# EAGLE design base-6u-generic-m16-v2 (EAGLE 5.06)
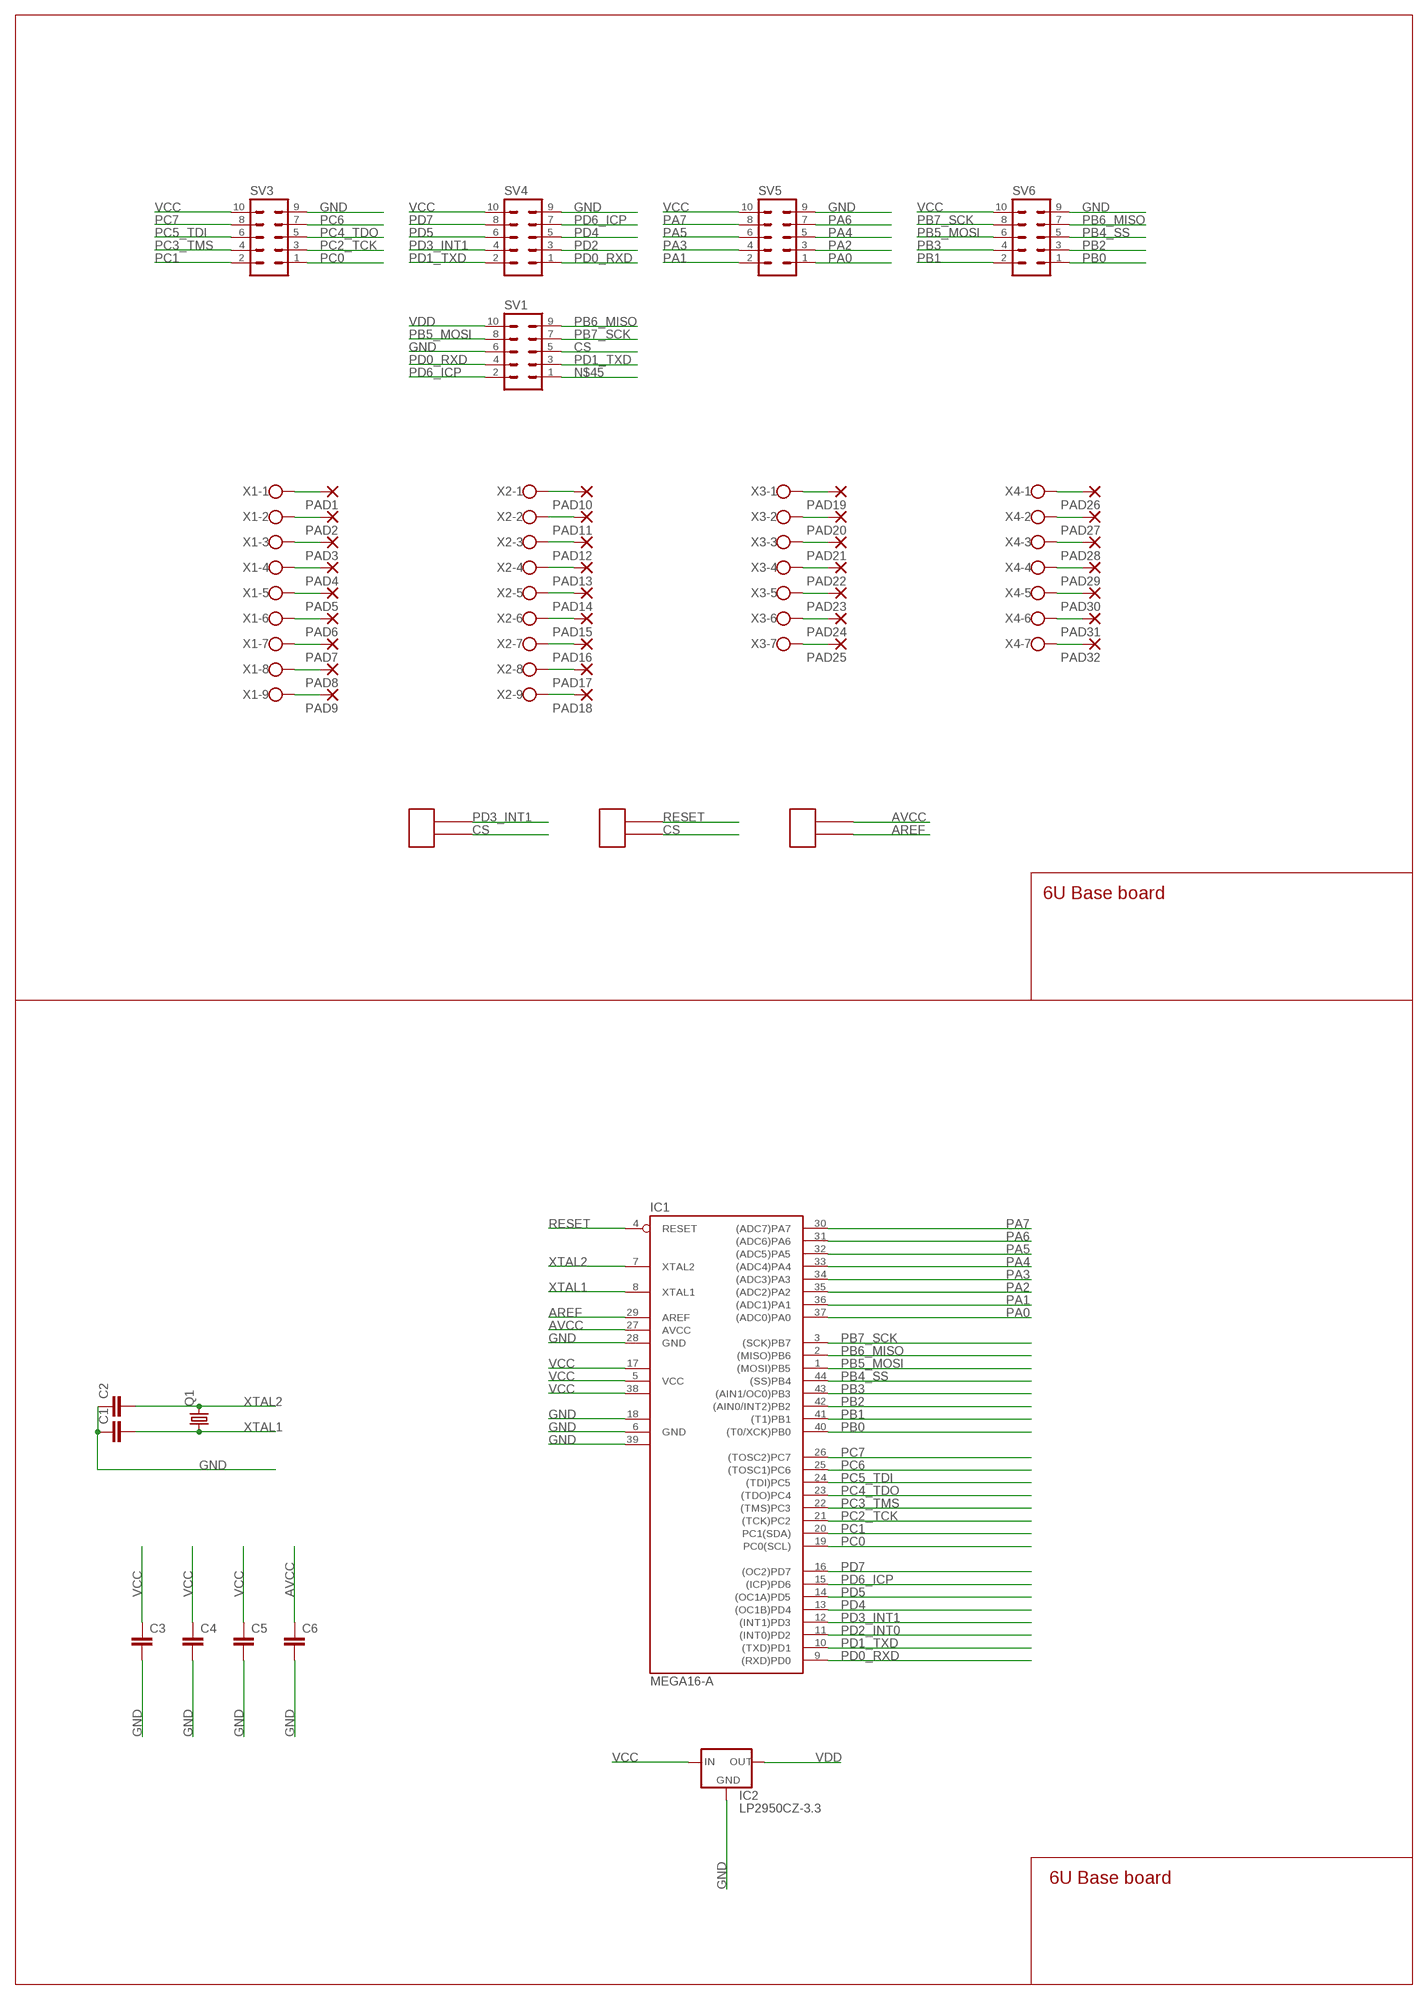
[diagram p0: schematic, sheet 1]

## Parts
C1  C-EUC0805  [C0805]
C2  C-EUC0805  [C0805]
C3  C-EUC0603  [C0603]
C4  C-EUC0603  [C0603]
C5  C-EUC0603  [C0603]
C6  C-EUC0603  [C0603]
IC1  MEGA16-A  [TQFP44]
IC2  LP2950CZ-3.3  [TO92]
PAD1  2,54/0,8  [2,54/0,8]
PAD2  2,54/0,8  [2,54/0,8]
PAD3  2,54/0,8  [2,54/0,8]
PAD4  2,54/0,8  [2,54/0,8]
PAD5  2,54/0,8  [2,54/0,8]
PAD6  2,54/0,8  [2,54/0,8]
PAD7  2,54/0,8  [2,54/0,8]
PAD8  2,54/0,8  [2,54/0,8]
PAD9  2,54/0,8  [2,54/0,8]
PAD10  2,54/0,8  [2,54/0,8]
PAD11  2,54/0,8  [2,54/0,8]
PAD12  2,54/0,8  [2,54/0,8]
PAD13  2,54/0,8  [2,54/0,8]
PAD14  2,54/0,8  [2,54/0,8]
PAD15  2,54/0,8  [2,54/0,8]
PAD16  2,54/0,8  [2,54/0,8]
PAD17  2,54/0,8  [2,54/0,8]
PAD18  2,54/0,8  [2,54/0,8]
PAD19  2,54/0,8  [2,54/0,8]
PAD20  2,54/0,8  [2,54/0,8]
PAD21  2,54/0,8  [2,54/0,8]
PAD22  2,54/0,8  [2,54/0,8]
PAD23  2,54/0,8  [2,54/0,8]
PAD24  2,54/0,8  [2,54/0,8]
PAD25  2,54/0,8  [2,54/0,8]
PAD26  2,54/0,8  [2,54/0,8]
PAD27  2,54/0,8  [2,54/0,8]
PAD28  2,54/0,8  [2,54/0,8]
PAD29  2,54/0,8  [2,54/0,8]
PAD30  2,54/0,8  [2,54/0,8]
PAD31  2,54/0,8  [2,54/0,8]
PAD32  2,54/0,8  [2,54/0,8]
Q1  CRYSTALHC49S  [HC49/S]
SV1  MA05-2  [MA05-2]
SV3  MA05-2  [MA05-2]
SV4  MA05-2  [MA05-2]
SV5  MA05-2  [MA05-2]
SV6  MA05-2  [MA05-2]
U$1  MA02-1  [MA02-1]
U$2  MA02-1  [MA02-1]
U$3  MA02-1  [MA02-1]
X1  W237-09P  [W237-9P]
X2  W237-09P  [W237-9P]
X3  W237-07P  [W237-7P]
X4  W237-07P  [W237-7P]

## Nets
AREF: IC1.29(AREF) U$3.P1
AVCC: C6.1 IC1.27(AVCC) U$3.P2
CS: SV1.5 U$1.P1 U$2.P1
GND: C1.1 C2.1 C3.2 C4.2 C5.2 C6.2 IC1.6(GND) IC1.18(GND1) IC1.28(GND) IC1.39(GND2) IC2.2(GND) SV1.6 SV3.9 SV4.9 SV5.9 SV6.9
N$1: PAD1.1(P) X1.1
N$2: PAD2.1(P) X1.2
N$3: PAD3.1(P) X1.3
N$5: PAD4.1(P) X1.4
N$6: PAD5.1(P) X1.5
N$7: PAD6.1(P) X1.6
N$8: PAD7.1(P) X1.7
N$9: PAD8.1(P) X1.8
N$11: PAD9.1(P) X1.9
N$12: PAD10.1(P) X2.1
N$13: PAD11.1(P) X2.2
N$14: PAD12.1(P) X2.3
N$15: PAD13.1(P) X2.4
N$16: PAD14.1(P) X2.5
N$17: PAD15.1(P) X2.6
N$18: PAD16.1(P) X2.7
N$19: PAD17.1(P) X2.8
N$20: PAD18.1(P) X2.9
N$21: PAD19.1(P) X3.1
N$22: PAD20.1(P) X3.2
N$23: PAD21.1(P) X3.3
N$24: PAD22.1(P) X3.4
N$25: PAD23.1(P) X3.5
N$26: PAD24.1(P) X3.6
N$27: PAD25.1(P) X3.7
N$28: PAD26.1(P) X4.1
N$29: PAD27.1(P) X4.2
N$30: PAD28.1(P) X4.3
N$31: PAD29.1(P) X4.4
N$32: PAD30.1(P) X4.5
N$33: PAD31.1(P) X4.6
N$34: PAD32.1(P) X4.7
N$45: SV1.1
PA0: IC1.37((ADC0)PA0) SV5.1
PA1: IC1.36((ADC1)PA1) SV5.2
PA2: IC1.35((ADC2)PA2) SV5.3
PA3: IC1.34((ADC3)PA3) SV5.4
PA4: IC1.33((ADC4)PA4) SV5.5
PA5: IC1.32((ADC5)PA5) SV5.6
PA6: IC1.31((ADC6)PA6) SV5.7
PA7: IC1.30((ADC7)PA7) SV5.8
PB0: IC1.40((T0/XCK)PB0) SV6.1
PB1: IC1.41((T1)PB1) SV6.2
PB2: IC1.42((AIN0/INT2)PB2) SV6.3
PB3: IC1.43((AIN1/OC0)PB3) SV6.4
PB4_SS: IC1.44((SS)PB4) SV6.5
PB5_MOSI: IC1.1((MOSI)PB5) SV1.8 SV6.6
PB6_MISO: IC1.2((MISO)PB6) SV1.9 SV6.7
PB7_SCK: IC1.3((SCK)PB7) SV1.7 SV6.8
PC0: IC1.19(PC0(SCL)) SV3.1
PC1: IC1.20(PC1(SDA)) SV3.2
PC2_TCK: IC1.21((TCK)PC2) SV3.3
PC3_TMS: IC1.22((TMS)PC3) SV3.4
PC4_TDO: IC1.23((TDO)PC4) SV3.5
PC5_TDI: IC1.24((TDI)PC5) SV3.6
PC6: IC1.25((TOSC1)PC6) SV3.7
PC7: IC1.26((TOSC2)PC7) SV3.8
PD0_RXD: IC1.9((RXD)PD0) SV1.4 SV4.1
PD1_TXD: IC1.10((TXD)PD1) SV1.3 SV4.2
PD2: SV4.3
PD2_INT0: IC1.11((INT0)PD2)
PD3_INT1: IC1.12((INT1)PD3) SV4.4 U$1.P2
PD4: IC1.13((OC1B)PD4) SV4.5
PD5: IC1.14((OC1A)PD5) SV4.6
PD6_ICP: IC1.15((ICP)PD6) SV1.2 SV4.7
PD7: IC1.16((OC2)PD7) SV4.8
RESET: IC1.4(RESET) U$2.P2
VCC: C3.1 C4.1 C5.1 IC1.5(VCC) IC1.17(VCC1) IC1.38(VCC2) IC2.3(IN) SV3.10 SV4.10 SV5.10 SV6.10
VDD: IC2.1(OUT) SV1.10
XTAL1: C1.2 IC1.8(XTAL1) Q1.1
XTAL2: C2.2 IC1.7(XTAL2) Q1.2

## Notes on the sheet
- 6U Base board
- 6U Base board

## Library data of the parts
C1-C6 = rcl:C-EU: CAPACITOR, European symbol
IC1 = atmel:MEGA16: MICROCONTROLLER 16 Kbytes FLASH 1 kbytes SRAM 512 bytes EEPROM USART 8-channel 10 bit ADC Source: avr.lbr
IC2 = v-reg:LP2950?*: Source: http://cache.national.com/ds/LP/LP2950.pdf
PAD1-PAD32 = wirepad:2,54/0,8: THROUGH-HOLE PAD
Q1 = crystal:CRYSTAL: CRYSTAL
SV1 SV3-SV6 = con-lstb:MA05-2: PIN HEADER
U$1-U$3 = my-con:MA02-1
X1 X2 = con-wago-508:W237-09P: WAGO SREW CLAMP
X3 X4 = con-wago-508:W237-07P: WAGO SREW CLAMP

## Board
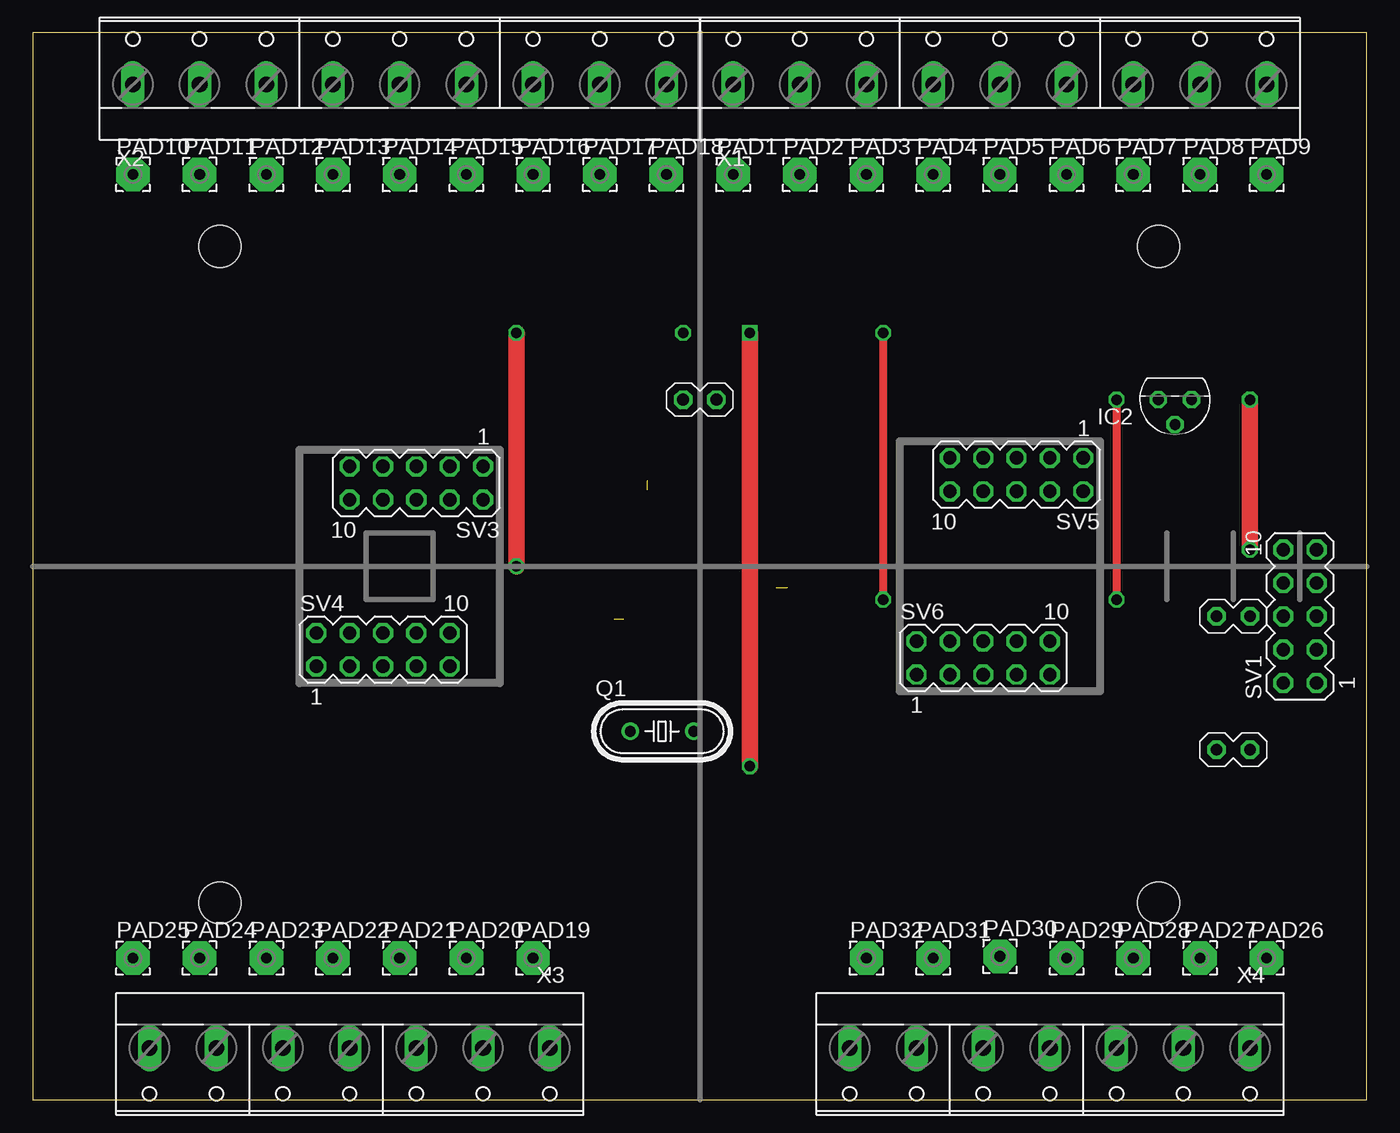
[diagram p1: board, top side]
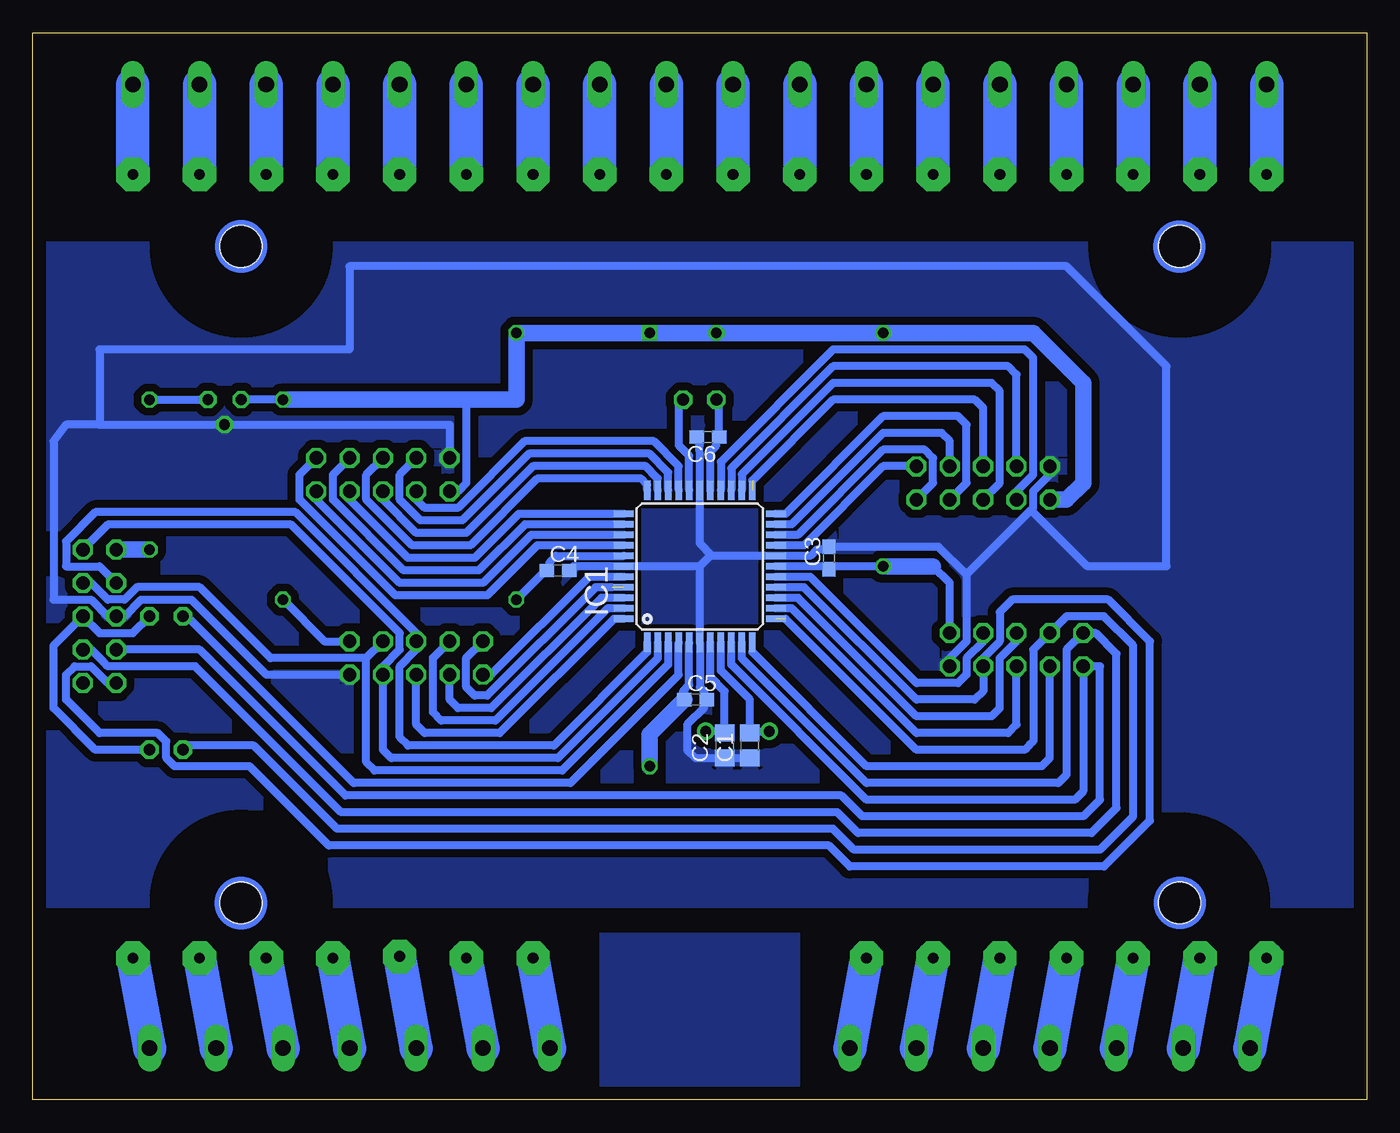
[diagram p2: board, bottom side, seen from below]

Size 101.6 x 81.28 mm. Coordinates in mm from the lower left corner, seen from the top.
Outline: 0,0.01 101.6,0 101.6,81.28 0,81.28 0,0.01
Copper layers (1*16): Top 0.035mm / dielectric 1.5mm / Bottom 0.035mm
Design rules "default": minimum track width 10mil, minimum drill 24mil, track to track 8mil, track to pad 8mil, pad to pad 8mil, via to via 8mil, smd to smd 8mil, copper to edge 40mil, drill to drill 8mil, minimum pad ring 10mil, minimum via ring 8mil, stop-mask expansion 4mil, vias tented up to drill 0mil, thermal gap 10mil
Holes 3.2 mm at 14.25,15 14.25,65 85.75,15 85.75,65
bRestrict: area 10.5,11.1 to 18.1,18.7; area 81.9,11.3 to 89.5,18.9; area 10.4,61.2 to 18,68.8; area 81.9,61.2 to 89.5,68.8

### Footprints (pad centres in the part's own frame; a part is rotated, then mirrored left to right if it is on the bottom)
C0805 = smd 1.3 x 1.5: 1 -0.95,0; 2 0.95,0
C0603 = smd 1.1 x 1: 1 -0.85,0; 2 0.85,0
TQFP44 = smd 1.5 x 0.5: 1 -5.8,4; 2 -5.8,3.2; 3 -5.8,2.4; 4 -5.8,1.6; 5 -5.8,0.8; 6 -5.8,0; 7 -5.8,-0.8; 8 -5.8,-1.6; 9 -5.8,-2.4; 10 -5.8,-3.2; 11 -5.8,-4; 23 5.8,-4; 24 5.8,-3.2; 25 5.8,-2.4; 26 5.8,-1.6; 27 5.8,-0.8; 28 5.8,0; 29 5.8,0.8; 30 5.8,1.6; 31 5.8,2.4; 32 5.8,3.2; 33 5.8,4 | smd 0.5 x 1.5: 12 -4,-5.8; 13 -3.2,-5.8; 14 -2.4,-5.8; 15 -1.6,-5.8; 16 -0.8,-5.8; 17 0,-5.8; 18 0.8,-5.8; 19 1.6,-5.8; 20 2.4,-5.8; 21 3.2,-5.8; 22 4,-5.8; 34 4,5.8; 35 3.2,5.8; 36 2.4,5.8; 37 1.6,5.8; 38 0.8,5.8; 39 0,5.8; 40 -0.8,5.8; 41 -1.6,5.8; 42 -2.4,5.8; 43 -3.2,5.8; 44 -4,5.8
TO92 = drill 0.813 octagon: 1 -1.27,0; 2 0,1.905; 3 1.27,0
2,54/0,8 = drill 0.813 pad 2.54 octagon: 1 0,0
HC49/S = drill 0.813 round: 1 -2.413,0; 2 2.413,0
MA05-2 = drill 1.016 octagon: 1 -5.08,-1.27; 2 -5.08,1.27; 3 -2.54,-1.27; 4 -2.54,1.27; 5 0,-1.27; 6 0,1.27; 7 2.54,-1.27; 8 2.54,1.27; 9 5.08,-1.27; 10 5.08,1.27
MA02-1 = drill 0.9 octagon: P1 -1.27,0; P2 1.27,0
W237-9P = drill 1.194 long: 1 -20.32,-0.635; 2 -15.24,-0.635; 3 -10.16,-0.635; 4 -5.08,-0.635; 5 0,-0.635; 6 5.08,-0.635; 7 10.16,-0.635; 8 15.24,-0.635; 9 20.32,-0.635
W237-7P = drill 1.194 long: 1 -15.24,-0.635; 2 -10.16,-0.635; 3 -5.08,-0.635; 4 0,-0.635; 5 5.08,-0.635; 6 10.16,-0.635; 7 15.24,-0.635

### Placement (x,y rotation side)
C1  46.99,26.99 90 bottom
C2  48.9,26.99 90 bottom
C3  40.96,41.27 90 bottom
C4  61.6,40.32 0 bottom
C5  51.12,30.48 0 bottom
C6  50.17,50.48 180 bottom
IC1  50.8,40.64 90 bottom
IC2  87,53.34 180 top
PAD1  53.34,70.48 0 top
PAD2  58.42,70.48 0 top
PAD3  63.5,70.48 0 top
PAD4  68.58,70.48 0 top
PAD5  73.66,70.48 0 top
PAD6  78.74,70.48 0 top
PAD7  83.82,70.48 0 top
PAD8  88.9,70.48 0 top
PAD9  93.98,70.48 0 top
PAD10  7.62,70.48 0 top
PAD11  12.7,70.48 0 top
PAD12  17.78,70.48 0 top
PAD13  22.86,70.48 0 top
PAD14  27.94,70.48 0 top
PAD15  33.02,70.48 0 top
PAD16  38.1,70.48 0 top
PAD17  43.18,70.48 0 top
PAD18  48.26,70.48 0 top
PAD19  38.1,10.79 0 top
PAD20  33.02,10.79 0 top
PAD21  27.94,10.79 0 top
PAD22  22.86,10.79 0 top
PAD23  17.78,10.79 0 top
PAD24  12.7,10.79 0 top
PAD25  7.62,10.79 0 top
PAD26  93.98,10.79 0 top
PAD27  88.9,10.79 0 top
PAD28  83.82,10.79 0 top
PAD29  78.74,10.79 0 top
PAD30  73.66,10.92 0 top
PAD31  68.58,10.79 0 top
PAD32  63.5,10.79 0 top
Q1  47.93,28.07 0 top
SV1  96.52,36.83 90 top
SV3  29.21,46.99 180 top
SV4  26.67,34.29 0 top
SV5  74.93,47.62 180 top
SV6  72.39,33.66 0 top
U$1  91.44,26.67 180 top
U$2  91.44,36.83 180 top
U$3  50.8,53.34 180 top
X1  73.66,77.98 0 top
X2  27.94,77.98 0 top
X3  24.13,3.3 180 top
X4  77.47,3.3 180 top

### Tracks (layer width: path | path; a pad name or v marks a point on that pad's centre or on a via)
AREF
  Bottom 0.61: IC1.29 51.6,49.06 52.07,49.53 52.39,49.85 52.39,53.02 U$3.P1
AVCC
  Bottom 0.61: IC1.27 50,49.38 49.53,49.85 49.53,50.27 C6.1 49.32,53.12 U$3.P2
CS
  Bottom 0.61: U$2.P1 93.98,35.56 94.62,35.56 96.52,35.56 SV1.5 100.02,34.61 100.02,29.84 96.84,26.67 U$1.P1
GND
  Bottom 0.61: C1.1 C2.1 51.12,26.04 51.76,26.67 51.76,28.57 50.48,29.85 50.48,30.16 50.27,30.38 C5.2 50.49,30.7 50.49,31.11 50.8,31.43 IC1.6 | C4.2 60.43,40.64 IC1.39 50.81,40.64 50.8,40.64 | IC1.6 | C6.2 50.8,50.38 50.8,49.85 50.8,48.89 IC1.28 50.8,42.39 49.85,41.44 | SV6.9 83.83,32.39 89.54,38.1 | 93.35,38.1 89.54,38.1 | 94.62,36.83 93.35,38.1 | 94.62,36.83 SV1.6 | SV4.9 31.75,33.66 30.48,34.92 30.48,40.01 | 25.56,44.93 30.48,40.01 | 25.56,44.93 25.4,45.09 25.4,46.35 24.13,47.62 SV3.9 | 93.35,38.1 89.54,38.1 | 94.62,36.83 93.35,38.1 | 94.62,36.83 95.89,36.83 97.16,38.1 100.02,38.1 100.02,50.16 99.06,51.44 96.52,51.44 | 50.8,40.64 IC1.6 | IC1.6 | 49.85,41.44 50.01,41.44 50.8,40.64 | 49.85,41.44 IC1.18 42.39,41.44 41.91,41.91 41.18,41.91 C3.2 32.6,42.12 30.48,40.01 | 96.52,51.44 IC2.2 | IC2.2 69.85,51.44 SV5.9 | 96.52,51.44 IC2.2 | 96.52,51.44 96.52,57.15 77.47,57.15 77.47,63.5 22.86,63.5 15.24,55.88 15.24,40.64 21.28,40.64 25.56,44.93
  pour Bottom (isolate 0.61): 0,64.77 101.6,64.77 101.6,15.24 0,15.24
  pour Bottom: 43.18,0 43.18,12.7 58.42,12.7 58.42,0
N$1
  Bottom 2.54: PAD1.1 X1.1
N$2
  Bottom 2.54: PAD2.1 X1.2
N$3
  Bottom 2.54: PAD3.1 X1.3
N$5
  Bottom 2.54: PAD4.1 X1.4
N$6
  Bottom 2.54: PAD5.1 X1.5
N$7
  Bottom 2.54: PAD6.1 X1.6
N$8
  Bottom 2.54: PAD7.1 X1.7
N$9
  Bottom 2.54: PAD8.1 X1.8
N$11
  Bottom 2.54: PAD9.1 X1.9
N$12
  Bottom 2.54: PAD10.1 X2.1
N$13
  Bottom 2.54: PAD11.1 X2.2
N$14
  Bottom 2.54: PAD12.1 X2.3
N$15
  Bottom 2.54: X2.4 22.86,73.66 PAD13.1
N$16
  Bottom 2.54: PAD14.1 X2.5
N$17
  Bottom 2.54: PAD15.1 X2.6
N$18
  Bottom 2.54: PAD16.1 X2.7
N$19
  Bottom 2.54: PAD17.1 X2.8
N$20
  Bottom 2.54: PAD18.1 X2.9
N$21
  Bottom 2.54: X3.1 PAD19.1
N$22
  Bottom 2.54: X3.2 PAD20.1
N$23
  Bottom 2.54: X3.3 PAD21.1
N$24
  Bottom 2.54: X3.4 PAD22.1
N$25
  Bottom 2.54: X3.5 PAD23.1
N$26
  Bottom 2.54: X3.6 PAD24.1
N$27
  Bottom 2.54: X3.7 PAD25.1
N$28
  Bottom 2.54: X4.1 PAD26.1
N$29
  Bottom 2.54: X4.2 PAD27.1
N$30
  Bottom 2.54: X4.3 PAD28.1
N$31
  Bottom 2.54: X4.4 PAD29.1
N$32
  Bottom 2.54: X4.5 PAD30.1
N$33
  Bottom 2.54: X4.6 PAD31.1
N$34
  Bottom 2.54: X4.7 PAD32.1
PA0
  Bottom 0.61: IC1.37 58.43,42.24 59.06,42.23 63.19,42.23 67,38.42 73.98,38.42 81.28,45.72 81.28,47.62 SV5.1
PA1
  Bottom 0.61: IC1.36 63.65,43.04 67.31,39.37 73.66,39.37 80.01,45.72 SV5.2
PA2
  Bottom 0.61: IC1.35 64.12,43.84 67.63,40.32 73.35,40.32 78.74,45.72 78.74,47.62 SV5.3
PA3
  Bottom 0.61: IC1.34 64.59,44.64 67.95,41.27 73.03,41.27 77.47,45.72 SV5.4
PA4
  Bottom 0.61: IC1.33 54.8,46.86 55.25,47.31 63.19,47.31 68.27,42.23 72.71,42.23 76.2,45.72 76.2,47.62 SV5.5
PA5
  Bottom 0.61: IC1.32 54,47.33 54.93,48.26 63.5,48.26 68.58,43.18 72.39,43.18 74.93,45.72 SV5.6
PA6
  Bottom 0.61: IC1.31 53.2,47.8 54.61,49.21 63.82,49.21 68.9,44.13 72.08,44.13 73.66,45.72 73.66,47.62 SV5.7
PA7
  Bottom 0.61: IC1.30 52.4,48.27 54.3,50.16 64.14,50.16 69.22,45.09 71.76,45.09 72.39,45.72 SV5.8
PB0
  Bottom 0.61: IC1.40 59.23,39.84 66.68,32.38 SV6.1
PB1  (1 unrouted)
  Bottom 0.61: 57.49,39.04 58.76,39.04 67,30.8 67.95,30.8 68.58,31.43 68.58,33.66 SV6.2
PB2
  Bottom 0.61: IC1.42 58.29,38.24 66.68,29.84 69.22,29.84 69.85,30.48 SV6.3
PB3
  Bottom 0.61: IC1.43 57.82,37.44 66.36,28.89 70.49,28.89 71.12,29.53 71.12,33.66 SV6.4
PB4_SS
  Bottom 0.61: IC1.44 57.35,36.64 66.04,27.94 71.76,27.94 72.39,28.57 SV6.5
PB5_MOSI
  Bottom 0.61: IC1.1 54.8,34.1 61.92,26.99 73.03,26.99 73.66,27.62 73.66,33.02 72.39,34.29 SV6.6 72.39,35.56 81.6,44.77 96.84,44.77 99.06,42.55 99.06,40.64 96.52,40.64 SV1.8
PB6_MISO
  Bottom 0.61: IC1.2 54,33.63 61.6,26.04 74.3,26.04 74.93,26.67 SV6.7 74.93,33.02 73.66,34.29 73.66,35.56 81.92,43.81 95.89,43.81 SV1.9
PB7_SCK
  Bottom 0.61: IC1.3 53.2,33.16 61.28,25.08 75.57,25.08 76.2,25.72 76.2,33.66 | 76.2,33.66 SV6.8 | 76.2,33.66 76.21,33.66 83.51,33.66 88.9,39.05 93.67,39.05 93.98,38.73 94.62,38.1 95.89,38.1 97.16,39.37 SV1.7
PC0
  Bottom 0.61: IC1.19 42.86,42.24 36.83,48.26 SV3.1
PC1
  Bottom 0.61: IC1.20 43.33,43.04 36.83,49.53 33.66,49.53 33.02,48.9 33.02,46.99 SV3.2
PC2_TCK
  Bottom 0.61: IC1.21 43.8,43.84 36.83,50.8 32.39,50.8 31.75,50.16 SV3.3
PC3_TMS
  Bottom 0.61: SV3.4 30.48,46.99 30.48,51.44 31.12,52.07 36.83,52.07 44.27,44.64 IC1.22
PC4_TDO  (1 unrouted)
  Bottom 0.61: SV3.5 29.21,52.7 29.85,53.34 40.64,53.34 46.8,47.18
PC5_TDI
  Bottom 0.61: SV3.6 27.94,46.99 27.94,53.98 28.58,54.61 40.64,54.61 47.6,47.65 IC1.24
PC6
  Bottom 0.61: IC1.25 48.4,48.12 40.64,55.88 27.31,55.88 26.67,55.25 SV3.7
PC7
  Bottom 0.61: SV3.8 26.67,46.35 25.4,47.62 25.4,56.52 26.04,57.15 40.64,57.15 49.2,48.59 IC1.26
PD0_RXD
  Bottom 0.61: SV4.1 21.59,23.5 22.23,22.86 38.1,22.86 48.4,33.16 IC1.9 | SV4.1 | SV4.1 | SV1.4 88.9,34.29 77.79,23.18 40.01,23.18 38.42,21.59 21.59,21.59 20.32,22.86 20.32,33.02 SV4.1 | SV4.1
PD1_TXD
  Bottom 0.61: SV4.2 22.86,34.29 22.86,24.77 23.5,24.13 38.1,24.13 47.6,33.63 IC1.10 | SV4.2 | SV1.3 97.16,34.29 96.21,33.34 | 95.89,33.02 96.21,33.34 | 95.89,33.02 89.22,33.02 78.11,21.91 40.33,21.91 38.74,20.32 20.96,20.32 19.05,22.23 19.05,33.97 20.64,35.56 SV4.2 | 95.89,33.02 96.21,33.34 | SV4.2
PD2
  Bottom 0.61: SV4.3 24.13,26.04 24.77,25.4 38.1,25.4 46.8,34.1
PD3_INT1  (1 unrouted)
  Bottom 0.61: 25.72,26.99 26.04,26.67 | 25.72,26.99 25.4,27.3 25.4,34.29 SV4.4 22.86,36.83 20.01,36.83 17.78,34.61 17.78,21.59 20.32,19.05 39.06,19.05 40.64,20.64 78.43,20.64 84.78,26.99 89.86,26.99 U$1.P2 | 25.72,26.99 26.04,26.67 | 44.26,36.64 34.29,26.67 26.04,26.67
PD4
  Bottom 0.61: SV4.5 26.67,28.58 27.31,27.94 34.29,27.94 43.79,37.44 IC1.13
PD5
  Bottom 0.61: IC1.14 43.32,38.24 34.29,29.21 28.58,29.21 27.94,29.84 27.94,33.66 26.67,34.92 SV4.6
PD6_ICP
  Bottom 0.61: IC1.15 42.85,39.04 34.29,30.48 29.85,30.48 29.21,31.12 SV4.7 29.21,33.66 27.94,34.92 27.94,37.15 26.99,38.1 19.69,38.1 16.51,34.92 16.51,21.27 20.01,17.78 39.37,17.78 40.96,19.37 79.06,19.37 85.09,25.4 90.81,25.4 91.44,26.04 91.44,27.3 92.08,27.94 96.52,27.94 99.06,30.48 99.06,32.38 98.43,33.02 97.16,33.02 95.89,31.75 SV1.2
PD7
  Bottom 0.61: SV4.8 29.21,34.92 30.48,33.66 30.48,32.38 31.12,31.75 34.29,31.75 42.38,39.84 IC1.16
RESET
  Bottom 0.61: IC1.4 52.4,32.37 60.65,24.13 77.16,24.13 89.86,36.83 U$2.P2
VCC  (via drill 0.8)
  Top 0.61: v64.77,58.42 v64.77,38.1 | v82.55,53.34 v82.55,38.1
  Top 1.27: v54.61,58.42 v54.61,25.4 | v36.83,40.64 v36.83,58.42
  Bottom 0.61: IC1.38 61.76,41.44 62.23,40.96 | 62.23,40.96 62.23,40.54 C4.1 | C3.1 41.17,40.64 IC1.17 | IC1.5 51.6,31.59 52.07,31.11 52.07,30.58 C5.1 | SV4.10 31.75,39.37 33.02,40.64 | C3.1 40.75,40.64 | 62.23,40.96 62.23,40.64 v64.77,38.1 | SV6.10 79.38,34.93 v82.55,38.1 | SV5.10 69.22,46.35 68.58,46.99 68.58,53.34 | v82.55,53.34 IC2.3 | v36.83,40.64 40.96,40.64 C3.1
  Bottom 1.27: v54.61,25.4 54.61,27.84 C5.1 | v82.55,53.34 68.58,53.34 64.77,53.34 v64.77,58.42 v54.61,58.42 v49.53,58.42 v36.83,58.42 25.4,58.42 21.59,54.61 21.59,46.99 22.86,45.72 SV3.10 | 33.02,40.64 v36.83,40.64
VDD  (via drill 0.8)
  Top 1.27: v92.71,41.91 v92.71,53.34
  Bottom 0.61: v92.71,53.34 IC2.1
  Bottom 1.27: v92.71,41.91 SV1.10
XTAL1
  Bottom 0.61: Q1.1 46.86,28.07 C1.2 | IC1.8 49.2,32.69 46.99,30.48 C1.2 | C1.2
XTAL2
  Bottom 0.61: Q1.2 49.03,28.07 C2.2 | IC1.7 50,32.22 48.9,31.11 C2.2 | C2.2
(copper drawn outside any net)
  shapes: Bottom circle x4

### Text on the board
tDocu: ERRORS | SV1.1 is not connected